# Altium schematic sheet Support.SchDoc: Gimbal Support Schematic
size Letter; DrawnBy: Aidan Gratton; Organization: UW Robotics; Address1: 200 University Avenue; Address2: Waterloo; Address3: Ontario; Address4: Canada N2L 3G6; SheetNumber: 7; SheetTotal: 7
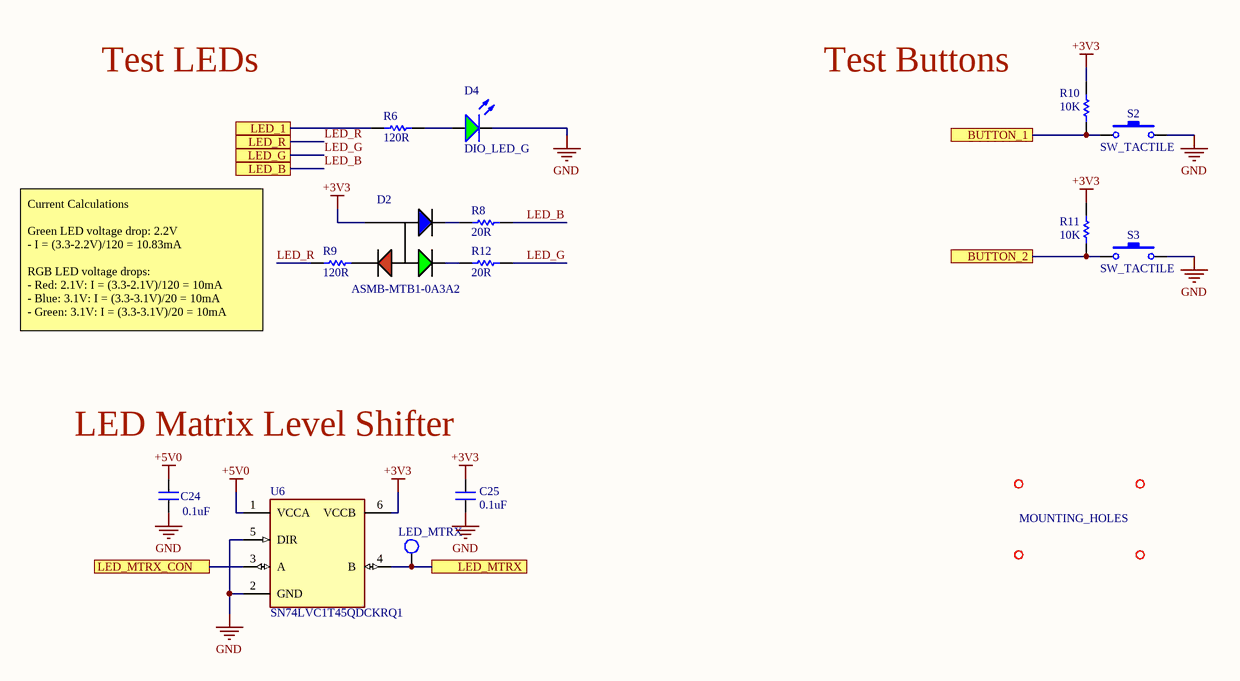
[diagram p0: Support.SchDoc]

## Parts
C24  value 0.1uF  [CAPC0603(1608)55_N]  (hidden comment: CAP_0.1uF_16V_0603)
C25  value 0.1uF  [CAPC0603(1608)55_N]  (hidden comment: CAP_0.1uF_16V_0603)
D2  Manufacturer Part Number 1: ASMB-MTB1-0A3A2  [LED_RGB]  (hidden comment: LED_RGB)
D4  DIO_LED_G  [LED_0805_LINE]
LED_MTRX  TESTPOINT_LOOP  [TESTPOINT_LOOP]  (value not drawn)
MH1  MOUNTING_HOLES  [MOUNTING_HOLE]
MH2  MOUNTING_HOLES  [MOUNTING_HOLE]  (value not drawn)
MH3  MOUNTING_HOLES  [MOUNTING_HOLE]  (value not drawn)
MH4  MOUNTING_HOLES  [MOUNTING_HOLE]  (value not drawn)
R6  value 120R  [RESC0603(1608)_N]  (hidden comment: RES_120R_0603)
R8  value 20R  [RESC0603(1608)_N]  (hidden comment: RES_20R_0603)
R9  value 120R  [RESC0603(1608)_N]  (hidden comment: RES_120R_0603)
R10  value 10K  [RESC0603(1608)_N]  (hidden comment: RES_10K_0603)
R11  value 10K  [RESC0603(1608)_N]  (hidden comment: RES_10K_0603)
R12  value 20R  [RESC0603(1608)_N]  (hidden comment: RES_20R_0603)
S2  SW_TACTILE  [B3U-1100P]
S3  SW_TACTILE  [B3U-1100P]
U6  SN74LVC1T45QDCKRQ1  [SOT65P210X110-6N]

## Ports
BUTTON_1, BUTTON_2, LED_1, LED_B, LED_G, LED_MTRX, LED_MTRX_CON, LED_R

## Nets
+3V3: C25.2 D2.4 R10.1 R11.2 U6.6(VCCB)
+5V0: C24.2 U6.1(VCCA)
GND: C24.1 C25.1 D4.2(K) S2.2 S3.2 U6.2(GND) U6.5(DIR)
BUTTON_1: R10.2 S2.1 ; port BUTTON_1
BUTTON_2: R11.1 S3.1 ; port BUTTON_2
LED_1: R6.1 ; port LED_1
LED_B: R8.2 ; port LED_B
LED_G: R12.2 ; port LED_G
LED_MTRX: LED_MTRX.1 U6.4(B) ; port LED_MTRX
LED_MTRX_CON: U6.3(A) ; port LED_MTRX_CON
LED_R: R9.1 ; port LED_R
NetD2_1: D2.1 R9.2
NetD2_2: D2.2 R12.1
NetD2_3: D2.3 R8.1
NetD4_1: D4.1(A) R6.2

## Notes on the sheet
- Test LEDs
- (near R10) Test Buttons
- Current Calculations
  Green LED voltage drop: 2.2V
  - I = (3.3-2.2V)/120 = 10.83mA
  RGB LED voltage drops:
  - Red: 2.1V: I = (3.3-2.1V)/120 = 10mA
  - Blue: 3.1V: I = (3.3-3.1V)/20 = 10mA
  - Green: 3.1V: I = (3.3-3.1V)/20 = 10mA
- LED Matrix Level Shifter
- Title
- Size:
- Date:
- Letter
- Drawn By:
- Sheet
- of
- File:

## Library data of the parts
C24 C25 = CAP_0.1uF_16V_0603: CAP CER 0.1UF 16V X7R 0603; Manufacturer Part Number 1: CC0603KRX7R7BB104; Manufacturer 1: Yageo; Dimensions: 0.063" L x 0.031" W (1.60mm x 0.80mm); Package: 0603 (1608 Metric); Temperature Coefficient: X7R; Supplier Part Number 1: 311-1088-1-ND; Supplier 1: Digi-Key; Mount: Surface Mount; Voltage Rating: 16V
D2 = LED_RGB: LED RGB DIFFUSED 4PLCC SMD; Manufacturer 1: Broadcom; Color: Blue,Green,Red; Lens Color: White; Viewing Angle: 115°; Lens Style: Round; Luminous Intensity: 350mcd; Dominant Wavelength: 470nm; Forward Voltage: 3.1V; Test Current: 20mA; Supplier 1: Digi-Key; Stock 1: 142531; Pricing 1: 1=0.60000, 10=0.47100, 100=0.30210, 500=0.25980, 1000=0.20059 (USD); RoHS: Yes; Mount: Surface Mount; Case/Package: PLCC; Number of Pins: 4; Packaging: Cut Tape; Lens Transparency: Diffused; Length: 3.2mm; Height: 1.9mm; Width: 2.8mm; REACH SVHC: No SVHC; ComponentLink1URL: http://www.farnell.com/datasheets/2111106.pdf?src-supplier=Farnell; ComponentLink1Description: http://www.farnell.com/datasheets/2111106.pdf?src-supplier=Farnell; ComponentLink2URL: https://docs.broadcom.com/docs/AV02-4194EN?src-supplier=Digi-Key; ComponentLink2Description: https://docs.broadcom.com/docs/AV02-4194EN?src-supplier=Digi-Key; ComponentLink3URL: http://www.farnell.com/datasheets/1801564.pdf?src-supplier=Element14; ComponentLink3Description: http://www.farnell.com/datasheets/1801564.pdf?src-supplier=Element14; ComponentLink4URL: http://www.farnell.com/datasheets/2111106.pdf?src-supplier=Newark; ComponentLink4Description: http://www.farnell.com/datasheets/2111106.pdf?src-supplier=Newark; Supplier Part Number 1: 516-3280-1-ND
D4 = DIO_LED_G: LED GREEN DIFFUSED 0805 SMD; Manufacturer: OSRAM; MPN: LG R971-KN-1; Forward Voltage Drop: 2.2V; Package: 0805 (2012 Metric); Supplier Part Number 1: 475-1410-1-ND; Supplier 1: Digi-Key
LED_MTRX = TESTPOINT_LOOP: Loop testpoint through-hole pad; Manufacturer 1: Keystone Electronics; Manufacturer Part Number 1: 5002; Supplier Part Number 1: 36-5002-ND; Supplier 1: Digi-Key; Mount: Through Hole
MH1-MH4 = MOUNTING_HOLES: 6cm x 6cm
R6 R9 = RES_120R_0603: RES SMD 120 OHM 5% 1/10W 0603; Manufacturer: Yageo; MPN: RC0603JR-07120RL; Package: 0603 (1608 Metric); Dimensions: 0.063" L x 0.031" W (1.60mm x 0.80mm); Tolerance: 5%; Supplier Part Number 1: 311-120GRCT-ND; Supplier 1: Digi-Key
R8 R12 = RES_20R_0603: RES SMD 20 OHM 5% 1/10W 0603; Manufacturer: Yageo; MPN: RC0603JR-0720RL; Package: 0603 (1608 Metric); Dimensions: 0.063" L x 0.031" W (1.60mm x 0.80mm); Tolerance: 5%; Supplier Part Number 1: 311-20GRCT-ND; Supplier 1: Digi-Key
R10 R11 = RES_10K_0603: RES SMD 10K OHM 5% 1/10W 0603; Manufacturer: Yageo; MPN: RC0603JR-0710KL; Package: 0603 (1608 Metric); Dimensions: 0.063" L x 0.031" W (1.60mm x 0.80mm); Tolerance: 5%; Supplier Part Number 1: 311-10KGRCT-ND; Supplier 1: Digi-Key
S2 S3 = SW_TACTILE: Tactile Switch (Grey); Manufacturer: Omron Electronics Inc-EMC Div; MPN: B3U-1100P; Supplier Part Number 1: SW1021CT-ND; Supplier 1: Digi-Key
U6 = IC_LVL_SHIFTER_TI: IC BIDIRECTIONAL LEVEL SHIFTER; Manufacturer 1: Texas Instruments; Data Rate: 420Mbps; Number of Channels: 1; Logic Function: Translator; Turn-On Delay Time: 6.9ns; High Level Output Current: -32mA; Low Level Output Current: 32mA; Quiescent Current: 10uA; Max Supply Voltage: 5.5V; Min Supply Voltage: 1.65V; Supplier 1: Digi-Key; Manufacturer Part Number 1: SN74LVC1T45QDCKRQ1; Stock 1: 7633; Pricing 1: 1=0.59000, 10=0.51500, 25=0.48360, 100=0.39470, 250=0.36660, 500=0.31200, 1000=0.24960 (USD); RoHS: Yes; Mount: Surface Mount; Case/Package: SC; Number of Pins: 6; Weight: 0.000988oz; Min Operating Temperature: -40°C; Max Operating Temperature: 125°C; Number of Bits: 1; Channel Type: Bidirectional; Number of Circuits: 1; Packaging: Tape and Reel; Propagation Delay: 6.9ns; Package Quantity: 3000; Radiation Hardening: No; Lead Free: Lead Free; REACH SVHC: No SVHC; ComponentLink1URL: https://datasheet.ciiva.com/6615/sn74lvc1t45-q1-6615008.pdf?src-supplier=Digi-Key; ComponentLink1Description: https://datasheet.ciiva.com/6615/sn74lvc1t45-q1-6615008.pdf?src-supplier=Digi-Key; ComponentLink2URL: https://datasheet.ciiva.com/12072/sces677b-213901-12072996.pdf?src-supplier=Mouser; ComponentLink2Description: https://datasheet.ciiva.com/12072/sces677b-213901-12072996.pdf?src-supplier=Mouser; ComponentLink3URL: https://datasheet.ciiva.com/15096/getdatasheetpartid-701994-15096516.pdf?src-supplier=Verical; ComponentLink3Description: https://datasheet.ciiva.com/15096/getdatasheetpartid-701994-15096516.pdf?src-supplier=Verical; ComponentLink4URL: https://datasheet.ciiva.com/29887/sn74lvc1t45-q1-29887614.pdf?src-supplier=Avnet; ComponentLink4Description: https://datasheet.ciiva.com/29887/sn74lvc1t45-q1-29887614.pdf?src-supplier=Avnet; Supplier Part Number 1: 296-39212-1-ND